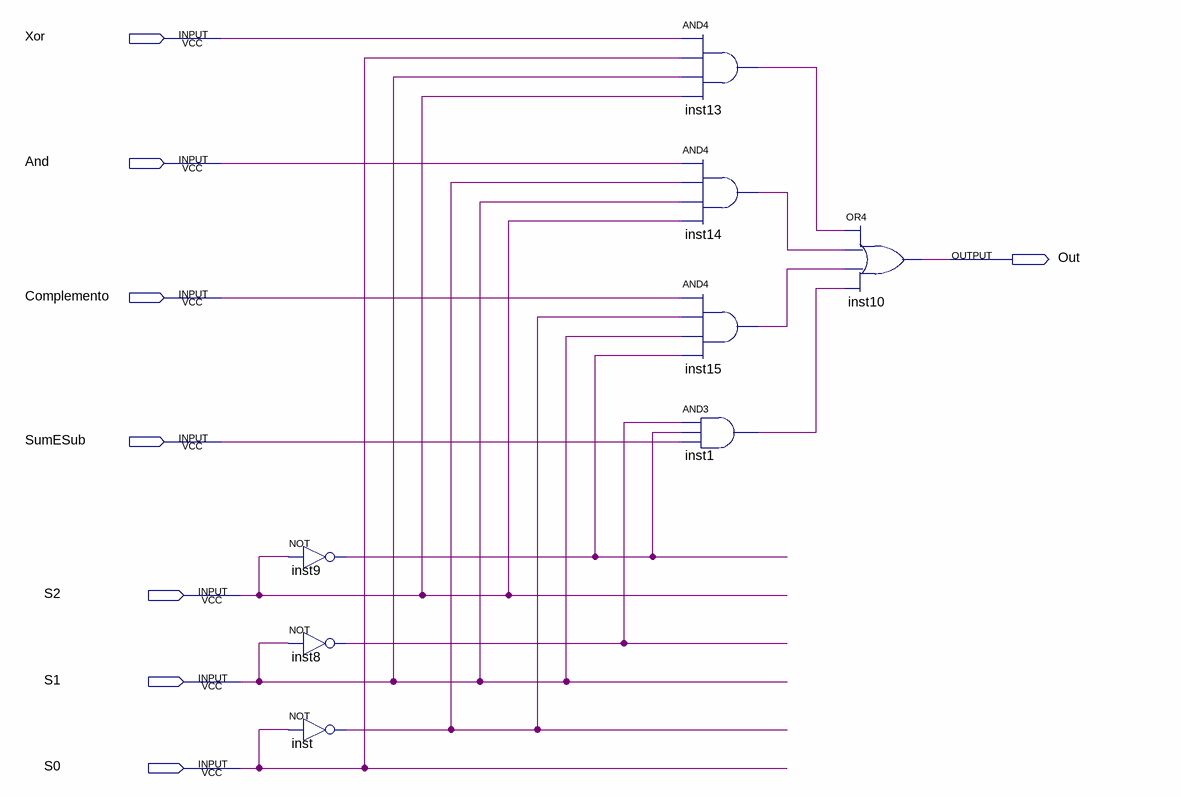
[diagram p0: schematic sheet]
// Quartus schematic MuxBit.bdf as structural Verilog: 8 symbols, 8 pins
module MuxBit (
  input  Xor,
  input  And,
  input  Complemento,
  input  SumESub,
  input  S2,
  input  S1,
  input  S0,
  output Out
);

  wire inst1_out, inst8_out, inst9_out, inst13_out, inst14_out, inst15_out, inst_out;

  not inst9 (inst9_out, S2);
  not inst8 (inst8_out, S1);
  not inst (inst_out, S0);
  and inst13 (inst13_out, Xor, S0, S1, S2);
  and inst14 (inst14_out, And, inst_out, S1, S2);
  and inst15 (inst15_out, Complemento, inst_out, S1, inst9_out);
  and inst1 (inst1_out, inst8_out, inst9_out, SumESub);
  or inst10 (Out, inst13_out, inst14_out, inst15_out, inst1_out);
endmodule
